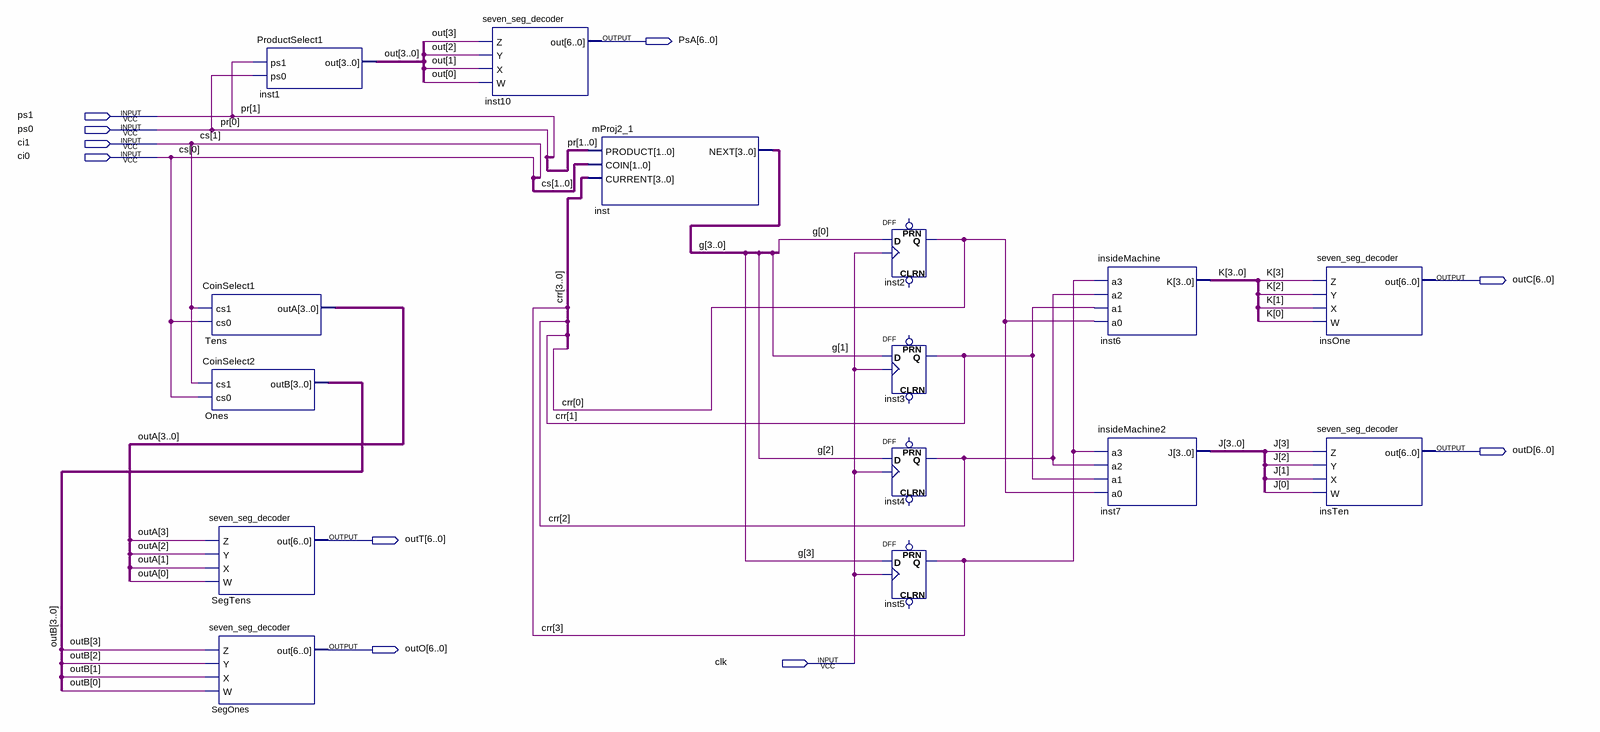
[diagram p0: schematic sheet]
// Quartus schematic mProj2_2.bdf as structural Verilog: 15 symbols, 10 pins
module mProj2_2 (
  input  ps1,
  input  ps0,
  input  ci1,
  input  ci0,
  input  clk,
  output [6:0] PsA,
  output [6:0] outC,
  output [6:0] outD,
  output [6:0] outT,
  output [6:0] outO
);

  wire [3:0] crr, g, J, K, out, outA, outB;

  CoinSelect1 Tens (.cs1(ci1), .cs0(ci0), .outA(outA));
  CoinSelect2 Ones (.cs1(ci1), .cs0(ci0), .outB(outB));
  seven_seg_decoder SegTens (.Z(outA[3]), .Y(outA[2]), .X(outA[1]), .W(outA[0]), .out(outT));
  seven_seg_decoder SegOnes (.Z(outB[3]), .Y(outB[2]), .X(outB[1]), .W(outB[0]), .out(outO));
  ProductSelect1 inst1 (.ps1(ps1), .ps0(ps0), .out(out));
  seven_seg_decoder inst10 (.Z(out[3]), .Y(out[2]), .X(out[1]), .W(out[0]), .out(PsA));
  mProj2_1 inst (.PRODUCT({ps1, ps0}), .COIN({ci1, ci0}), .CURRENT(crr), .NEXT(g));
  DFF inst2 (.CLK(clk), .D(g[0]), .Q(crr[0]));  // open: CLRN, PRN
  DFF inst3 (.CLK(clk), .D(g[1]), .Q(crr[1]));  // open: CLRN, PRN
  DFF inst4 (.CLK(clk), .D(g[2]), .Q(crr[2]));  // open: CLRN, PRN
  DFF inst5 (.CLK(clk), .D(g[3]), .Q(crr[3]));  // open: CLRN, PRN
  insideMachine inst6 (.a3(crr[3]), .a2(crr[2]), .a1(crr[1]), .a0(crr[0]), .K(K));
  insideMachine2 inst7 (.a3(crr[3]), .a2(crr[2]), .a1(crr[1]), .a0(crr[0]), .J(J));
  seven_seg_decoder insOne (.Z(K[3]), .Y(K[2]), .X(K[1]), .W(K[0]), .out(outC));
  seven_seg_decoder insTen (.Z(J[3]), .Y(J[2]), .X(J[1]), .W(J[0]), .out(outD));

  // Other names for the same wires on the sheet: cs[1:0] = {ci1, ci0}; pr[1:0] = {ps1, ps0}
endmodule
